# EAGLE design driver (EAGLE 8.1.0)
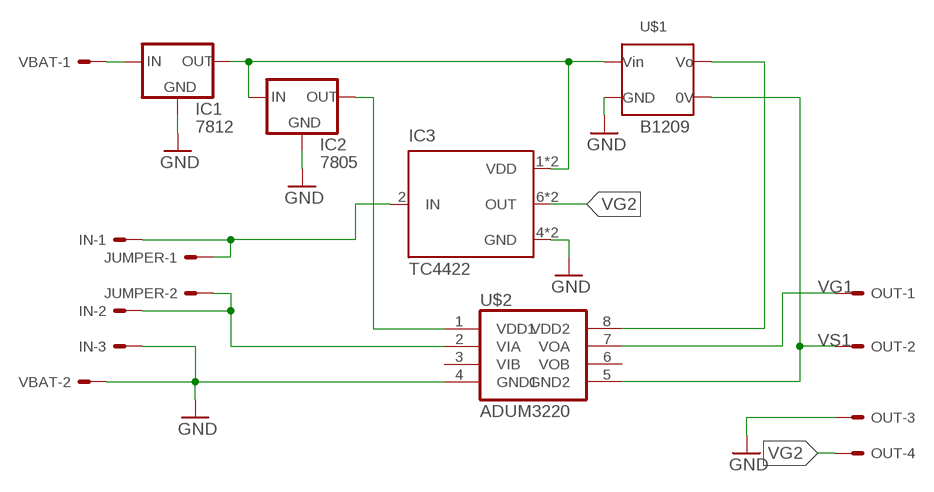
[diagram p0: schematic, sheet 1]

## Parts
IC1  7812  78XXS  [78XXS]
IC2  7805  78XXS  [78XXS]
IC3  TC4422  [DIL08]
IN  22-23-2031  [22-23-2031]
JUMPER  22-23-2021  [22-23-2021]
OUT  22-23-2041  [22-23-2041]
U$1  B1209  [22-23-2041]
U$2  ADUM3220  [SO8]
VBAT  22-23-2021  [22-23-2021]

## Nets
5V: IC2.OUT U$2.1(VDD1)
12V: IC1.OUT IC2.IN IC3.1(VDD) IC3.8(VDD) U$1.2(VIN)
GND: IC1.GND IC2.GND IC3.4(GND) IC3.5(GND) IN.3 OUT.3 U$1.1(GND) U$2.4(GND1) VBAT.2
N$5: IC1.IN VBAT.1
N$6: IN.2 JUMPER.2 U$2.2(VIA)
N$7: IC3.2(IN) IN.1 JUMPER.1
VDD2: U$1.4(VO) U$2.8(VDD2)
VG1: OUT.1 U$2.7(VOA)
VG2: IC3.6(OUT) IC3.7(OUT) OUT.4
VS1: OUT.2 U$1.3(0V) U$2.5(GND2)
Unconnected: U$2.3(VIB) U$2.6(VOB)

## Library data of the parts
IC1 IC2 = v-reg:78XXS: VOLTAGE REGULATOR
IC3 = felippe:TC4422: DUAL LOW SIDE DRIVER Source: ID4426.pdf; MF: INTERNATIONAL RECTIFIER(IR); MPN: IR4426PBF; OC_FARNELL: 1023265; OC_NEWARK: 19K8460
IN = con-molex:22-23-2031: .100" (2.54mm) Center Header - 3 Pin; MF: MOLEX; MPN: 22-23-2031; OC_FARNELL: 1462950; OC_NEWARK: 30C0862
JUMPER VBAT = con-molex:22-23-2021: .100" (2.54mm) Center Header - 2 Pin; MF: MOLEX; MPN: 22-23-2021; OC_FARNELL: 1462926; OC_NEWARK: 25C3832
OUT = con-molex:22-23-2041: .100" (2.54mm) Center Header - 4 Pin; MF: MOLEX; MPN: 22-23-2041; OC_FARNELL: 1462920; OC_NEWARK: 38C0355
U$1 = felippe:B1209
U$2 = felippe:ADUM3220

## Board
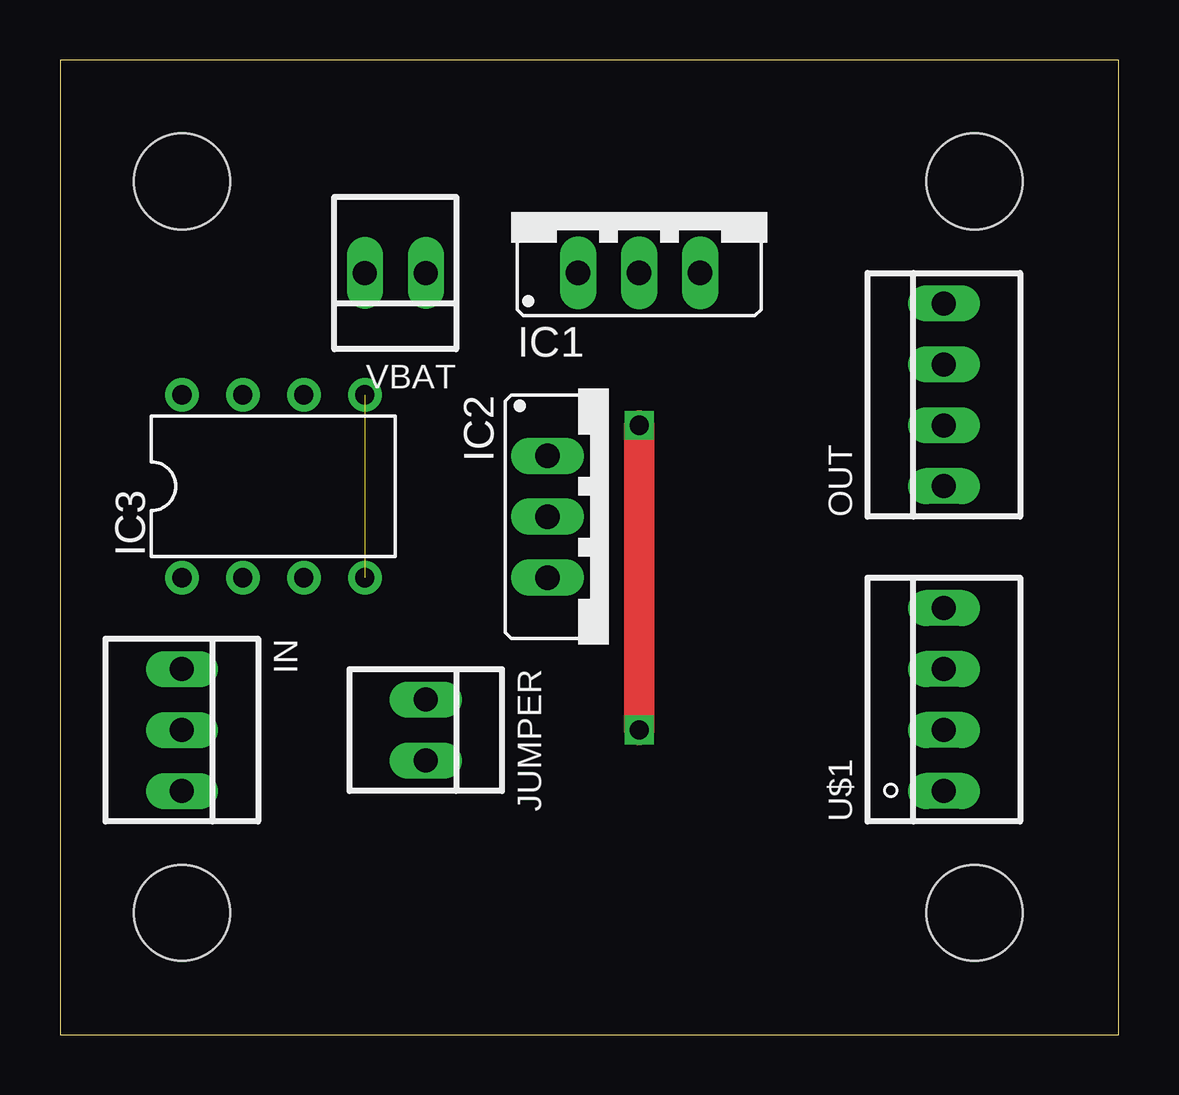
[diagram p1: board, top side]
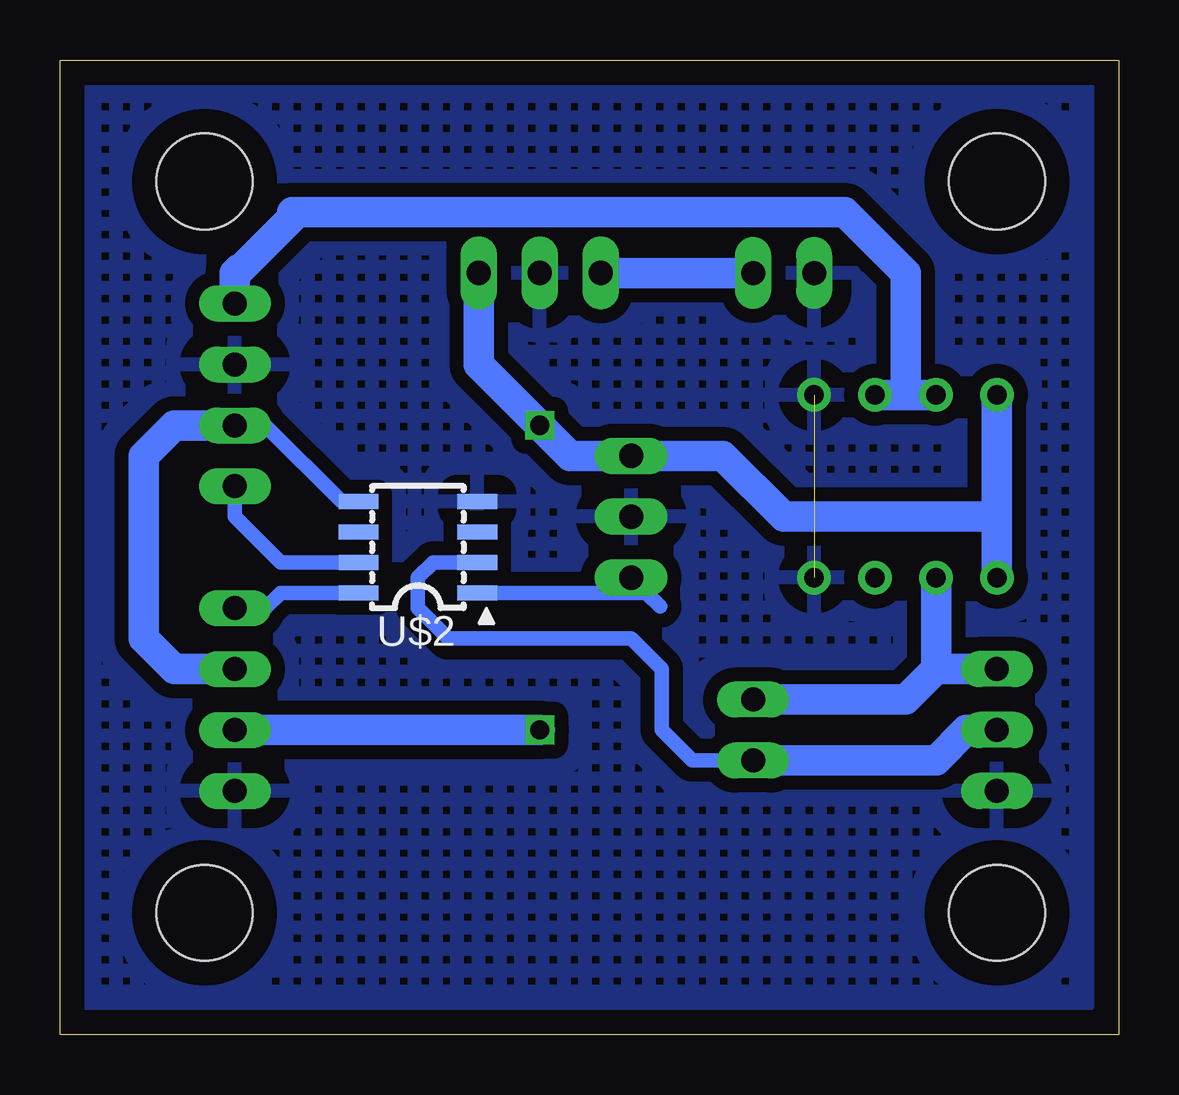
[diagram p2: board, bottom side, seen from below]

Size 44.12 x 40.63 mm. Coordinates in mm from the lower left corner, seen from the top.
Outline: 0,0 44.12,0 44.12,40.63 0,40.63 0,0
Copper layers (1*16): Top 0.035mm / dielectric 1.5mm / Bottom 0.035mm
Design rules "fresa": minimum track width 0.8mm, minimum drill 0.8mm, track to track 0.4mm, track to pad 0.4mm, pad to pad 0.4mm, via to via 0.4mm, smd to smd 6mil, copper to edge 40mil, drill to drill 8mil, minimum pad ring 10mil, minimum via ring 8mil, stop-mask expansion 4mil, vias tented up to drill 0mil, thermal gap 0.8mm
Holes 4 mm at 5.08,35.56 5.08,5.08 38.1,5.08 38.1,35.56

### Footprints (pad centres in the part's own frame; a part is rotated, then mirrored left to right if it is on the bottom)
78XXS = drill 1.016 long: GND 0,-2.54; IN -2.54,-2.54; OUT 2.54,-2.54
DIL08 = drill 0.8 pad 1.4: 1 -3.81,-3.81; 2 -1.27,-3.81; 3 1.27,-3.81; 4 3.81,-3.81; 5 3.81,3.81; 6 1.27,3.81; 7 -1.27,3.81; 8 -3.81,3.81
22-23-2031 = drill 1 long: 1 -2.54,0; 2 0,0; 3 2.54,0
22-23-2021 = drill 1 long: 1 -1.27,0; 2 1.27,0
22-23-2041 = drill 1 long: 1 -3.81,0; 2 -1.27,0; 3 1.27,0; 4 3.81,0
SO8 = smd 0.635 x 1.651: 1 -1.905,-2.477; 2 -0.635,-2.477; 3 0.635,-2.477; 4 1.905,-2.477; 5 1.905,2.477; 6 0.635,2.477; 7 -0.635,2.477; 8 -1.905,2.477

### Placement (x,y rotation side)
IC1  24.13,34.29 0 top
IC2  22.86,21.59 270 top
IC3  8.89,22.86 0 top
IN  5.08,12.7 270 top
JUMPER  15.24,12.7 270 top
OUT  36.83,26.67 90 top
U$1  36.83,13.97 90 top
U$2  29.21,20.32 90 bottom
VBAT  13.97,31.75 180 top

### Tracks (layer width: path | path; a pad name or v marks a point on that pad's centre or on a via)
5V
  Bottom 0.61: 19.68,18.41 IC2.OUT 20.95,18.41 | U$2.1 20.95,18.41 | 20.95,18.41 19.68,18.41 | 19.68,18.41 19.11,17.84
12V  (via drill 0.8)
  Top 1.27: v24.13,25.4 v24.13,12.7
  Bottom 1.27: IC1.OUT 26.67,27.94 v24.13,25.4 22.86,24.13 IC2.IN 16.51,24.13 13.97,21.59 5.08,21.59 | v24.13,12.7 U$1.2 | IC3.1 5.08,21.59 | 5.08,21.59 IC3.8
GND  (1 unrouted)
  pour Bottom (isolate 0.584, hatched): 1.27,1.27 1.27,39.37 43.18,39.37 43.18,1.27
N$5
  Bottom 1.27: VBAT.1 IC1.IN
N$6
  Bottom 0.61: U$2.2 28.57,19.68 29.21,19.05 29.21,17.78 27.94,16.51 20.32,16.51 19.05,15.24 19.05,12.7 17.78,11.43 JUMPER.2
  Bottom 1.27: IN.2 6.35,12.7 7.62,11.43 JUMPER.2
N$7
  Bottom 1.27: 7.62,15.24 IN.1 | 7.62,15.24 8.89,13.97 JUMPER.1 | IC3.2 7.62,15.24
VDD2
  Bottom 0.61: U$2.8 34.92,18.41 35.56,17.78 U$1.4
VG1
  Bottom 0.61: U$2.7 34.92,19.68 36.83,21.59 OUT.1
VG2
  Bottom 1.27: IC3.6 8.89,26.67 | IC3.7 8.89,26.67 | 8.89,26.67 8.89,31.75 11.43,34.29 34.45,34.29 34.45,34.05 36.59,31.91 36.67,31.91 36.83,31.75 OUT.4
VS1
  Bottom 0.61: U$2.5 32.38,22.23 35.56,25.4 OUT.2
  Bottom 1.27: U$1.3 39.37,15.24 40.64,16.51 40.64,24.13 39.37,25.4 OUT.2